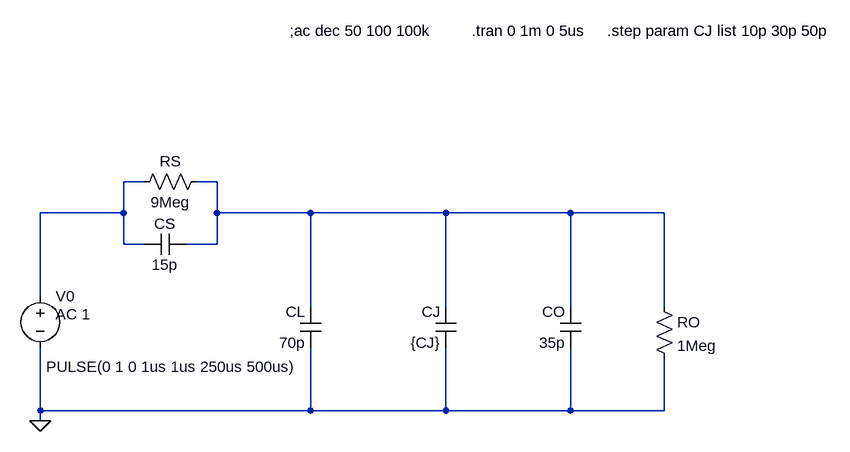
[diagram p0: schematic Teilertastkopf.asc]
Teilertastkopf.asc, the LTspice schematic file:
Version 4
SHEET 1 1004 680
WIRE -112 -992 -144 -992
WIRE 0 -992 -32 -992
WIRE -144 -944 -144 -992
WIRE -144 -944 -272 -944
WIRE 0 -944 0 -992
WIRE 144 -944 0 -944
WIRE 352 -944 144 -944
WIRE 544 -944 352 -944
WIRE 688 -944 544 -944
WIRE -144 -896 -144 -944
WIRE -112 -896 -144 -896
WIRE 0 -896 0 -944
WIRE 0 -896 -48 -896
WIRE -272 -816 -272 -944
WIRE 144 -800 144 -944
WIRE 352 -800 352 -944
WIRE 544 -800 544 -944
WIRE 688 -800 688 -944
WIRE -272 -640 -272 -736
WIRE 144 -640 144 -736
WIRE 144 -640 -272 -640
WIRE 352 -640 352 -736
WIRE 352 -640 144 -640
WIRE 544 -640 544 -736
WIRE 544 -640 352 -640
WIRE 688 -640 688 -720
WIRE 688 -640 544 -640
WIRE -272 -624 -272 -640
FLAG -272 -624 0
SYMBOL res -16 -1008 R90
WINDOW 0 0 56 VBottom 2
WINDOW 3 32 56 VTop 2
SYMATTR InstName RS
SYMATTR Value 9Meg
SYMBOL cap -48 -912 R90
WINDOW 0 0 32 VBottom 2
WINDOW 3 32 32 VTop 2
SYMATTR InstName CS
SYMATTR Value 15p
SYMBOL cap 160 -736 R180
WINDOW 0 24 56 Left 2
WINDOW 3 24 8 Left 2
SYMATTR InstName CL
SYMATTR Value 70p
SYMBOL cap 368 -736 R180
WINDOW 0 24 56 Left 2
WINDOW 3 24 8 Left 2
SYMATTR InstName CJ
SYMATTR Value {CJ}
SYMBOL cap 560 -736 R180
WINDOW 0 24 56 Left 2
WINDOW 3 24 8 Left 2
SYMATTR InstName CO
SYMATTR Value 35p
SYMBOL res 672 -816 R0
SYMATTR InstName RO
SYMATTR Value 1Meg
SYMBOL voltage -272 -832 R0
WINDOW 3 9 125 Left 2
WINDOW 123 24 44 Left 2
WINDOW 39 0 0 Left 0
SYMATTR InstName V0
SYMATTR Value PULSE(0 1 0 1us 1us 250us 500us)
SYMATTR Value2 AC 1
TEXT 112 -1224 Left 2 !;ac dec 50 100 100k
TEXT 392 -1224 Left 2 !.tran 0 1m 0 5us
TEXT 600 -1224 Left 2 !.step param CJ list 10p 30p 50p

The netlist it stands for:
* Teilertastkopf.asc
RS N002 N001 9Meg
CS N002 N001 15p
CL 0 N002 70p
CJ 0 N002 {CJ}
CO 0 N002 35p
RO N002 0 1Meg
V0 N001 0 PULSE(0 1 0 1us 1us 250us 500us) AC 1
;ac dec 50 100 100k
.tran 0 1m 0 5us
.step param CJ list 10p 30p 50p
.backanno
.end